# Altium schematic sheet 05 - USB.SchDoc
size 420 x 297 mm
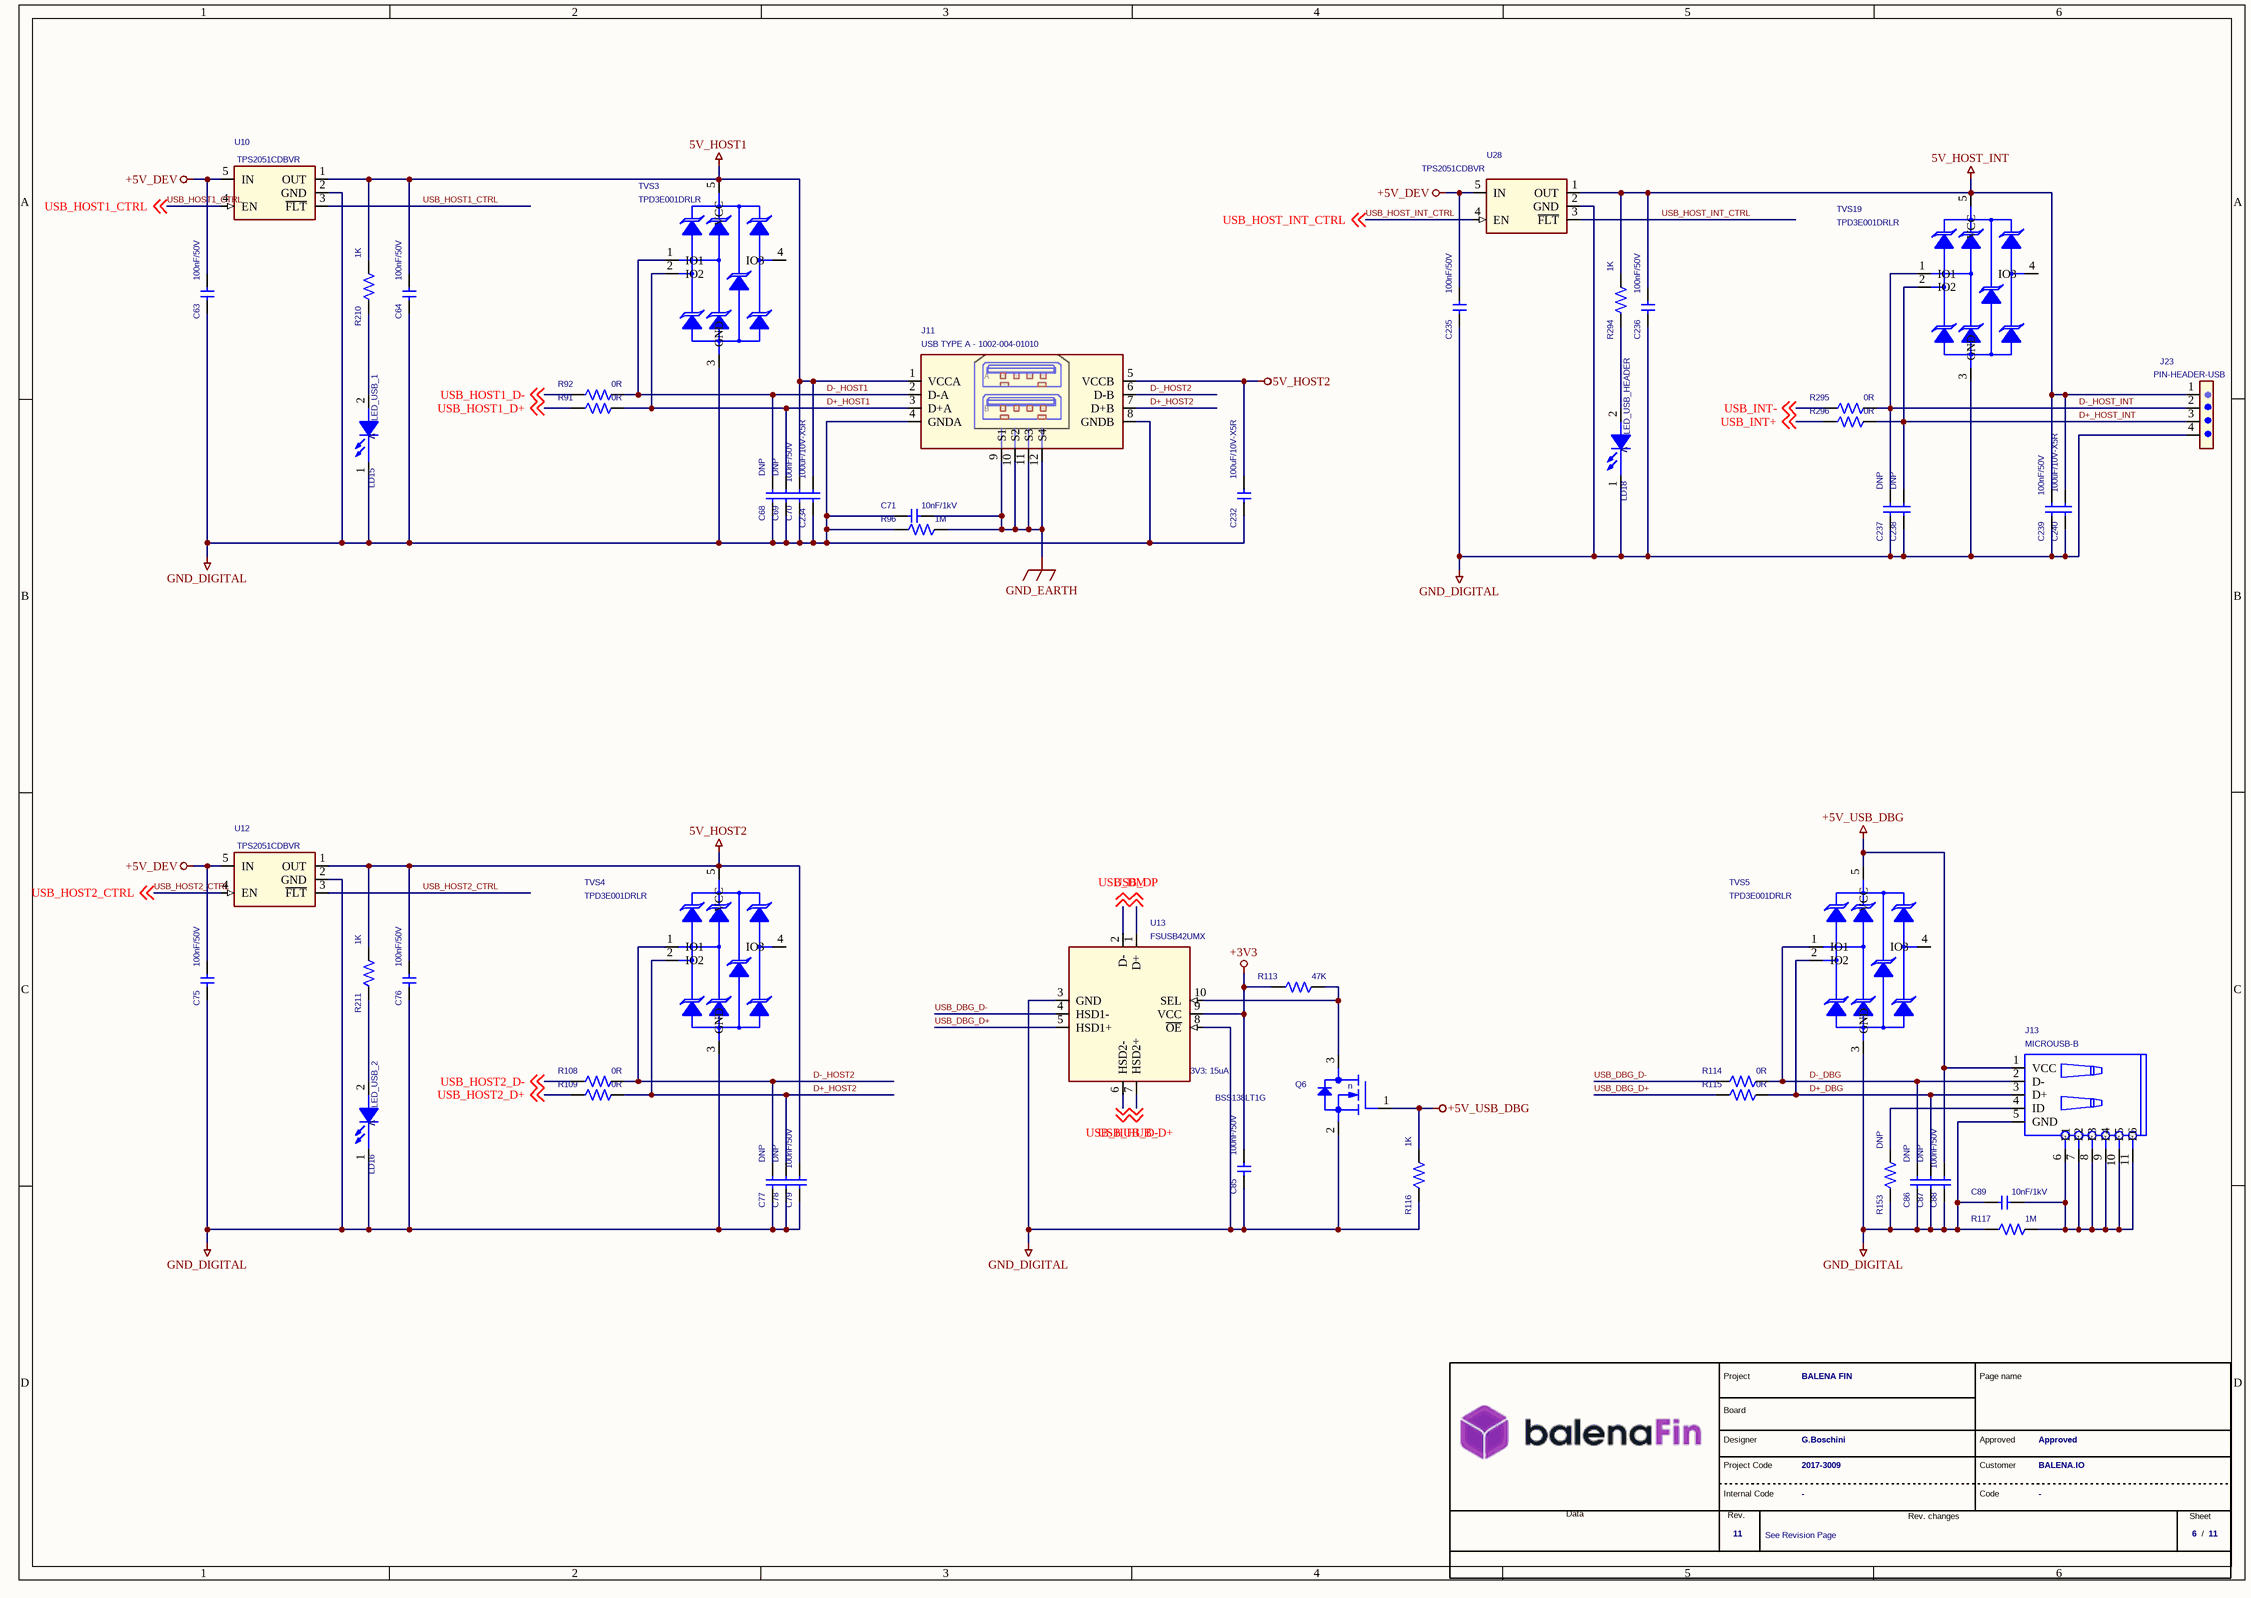
[diagram p0: 05 - USB.SchDoc]

## Parts
*  Revision: 11  FAE RD code: 2017-3009  DocumentoRev: See Revision Page  Page Number: 6  Nome Progetto: BALENA FIN  Customer name: BALENA.IO  Project manager: Approved  Project designer: G.Boschini  (hidden comment: MyFAEVuoto)  (graphical)
C63  100nF/50V  [CS-C-0402]
C64  100nF/50V  [CS-C-0402]
C68  DNP  [CS-C-0402]
C69  DNP  [CS-C-0402]
C70  100nF/50V  [CS-C-0402]
C71  10nF/1kV  [CS-C-1206]
C75  100nF/50V  [CS-C-0402]
C76  100nF/50V  [CS-C-0402]
C77  DNP  [CS-C-0402]
C78  DNP  [CS-C-0402]
C79  100nF/50V  [CS-C-0402]
C85  100nF/50V  [CS-C-0402]
C86  DNP  [CS-C-0402]
C87  DNP  [CS-C-0402]
C88  100nF/50V  [CS-C-0402]
C89  10nF/1kV  [CS-C-1206]
C232  100uF/10V-X5R  [CS-C-1210]
C234  100uF/10V-X5R  [CS-C-1210]
C235  100nF/50V  [CS-C-0402]
C236  100nF/50V  [CS-C-0402]
C237  DNP  [CS-C-0402]
C238  DNP  [CS-C-0402]
C239  100nF/50V  [CS-C-0402]
C240  100uF/10V-X5R  [CS-C-1210]
J11  USB TYPE A - 1002-004-01010  [J-8-0200-FOT-USB-A-2X]
J13  MICROUSB-B  [J-5-0065-FOS-MICROUSB10118192]
J23  PIN-HEADER-USB  [J-4-0254-MDT]
LD15  LED_USB_1  [LD-0603]
LD16  LED_USB_2  [LD-0603]
LD18  LED_USB_HEADER  [LD-0603]
Q6  BSS138LT1G  [SOT23]
R91  0R  [RS-0402]
R92  0R  [RS-0402]
R96  1M  [RS-1206]
R108  0R  [RS-0402]
R109  0R  [RS-0402]
R113  47K  [RS-0402]
R114  0R  [RS-0402]
R115  0R  [RS-0402]
R116  1K  [RS-0402]
R117  1M  [RS-1206]
R153  DNP  [RS-0402]
R210  1K  [RS-0402]
R211  1K  [RS-0402]
R294  1K  [RS-0402]
R295  0R  [RS-0402]
R296  0R  [RS-0402]
TVS3  TPD3E001DRLR  [SOP5_USON6]
TVS4  TPD3E001DRLR  [SOP5_USON6]
TVS5  TPD3E001DRLR  [SOP5_USON6]
TVS19  TPD3E001DRLR  [SOP5_USON6]
U10  TPS2051CDBVR  [SOT23-5]
U12  TPS2051CDBVR  [SOT23-5]
U13  FSUSB42UMX  Power requirements: 3V3: 15uA  [UMLP10]
U28  TPS2051CDBVR  [SOT23-5]

## Nets
5V_HOST1: C64.1 C70.1 C234.1 J11.1(VCCA) R210.2 TVS3.5(VCC) U10.1(OUT)
5V_HOST2: C76.1 C79.1 C232.1 J11.5(VCCB) R211.2 TVS4.5(VCC) U12.1(OUT)
5V_HOST_INT: C236.1 C239.1 C240.1 J23.1 R294.2 TVS19.5(VCC) U28.1(OUT)
+3V3: C85.1 R113.1 U13.9(VCC)
+5V_DEV: C63.1 C75.1 C235.1 U10.5(IN) U12.5(IN) U28.5(IN)
+5V_USB_DBG: C88.1 J13.1(VCC) Q6.1(G) R116.2 TVS5.5(VCC)
GND_DIGITAL: C63.2 C64.2 C68.2 C69.2 C70.2 C71.1 C75.2 C76.2 C77.2 C78.2 C79.2 C85.2 C86.2 C87.2 C88.2 C89.1 C232.2 C234.2 C235.2 C236.2 C237.2 C238.2 C239.2 C240.2 J11.4(GNDA) J11.8(GNDB) J13.5(GND) J23.4 LD15.1(C) LD16.1(C) LD18.1(C) Q6.2(S) R96.1 R116.1 R117.1 R153.1 TVS3.3(GND) TVS4.3(GND) TVS5.3(GND) TVS19.3(GND) U10.2(GND) U12.2(GND) U13.3(GND) U13.8(~{OE}) U28.2(GND)
GND_EARTH: C71.2 J11.9(S1) J11.10(S2) J11.11(S3) J11.12(S4) R96.2
D+_DBG: C87.1 J13.3(D+) R115.2 TVS5.2(IO2)
D+_HOST1: C69.1 J11.3(D+A) R91.2 TVS3.2(IO2)
D+_HOST2: C78.1 J11.7(D+B) R109.2 TVS4.2(IO2)
D+_HOST_INT: C238.1 J23.3 R296.2 TVS19.2(IO2)
D-_DBG: C86.1 J13.2(D-) R114.2 TVS5.1(IO1)
D-_HOST1: C68.1 J11.2(D-A) R92.2 TVS3.1(IO1)
D-_HOST2: C77.1 J11.6(D-B) R108.2 TVS4.1(IO1)
D-_HOST_INT: C237.1 J23.2 R295.2 TVS19.1(IO1)
USB_DBG_D+: R115.1 U13.5(HSD1+)
USB_DBG_D-: R114.1 U13.4(HSD1-)
USB_DM: U13.2(D-) ; off-sheet USB_DM
USB_DP: U13.1(D+) ; off-sheet USB_DP
USB_HOST1_CTRL: U10.3(~{FLT}) U10.4(EN) ; off-sheet USB_HOST1_CTRL
USB_HOST1_D+: R91.1 ; off-sheet USB_HOST1_D+
USB_HOST1_D-: R92.1 ; off-sheet USB_HOST1_D-
USB_HOST2_CTRL: U12.3(~{FLT}) U12.4(EN) ; off-sheet USB_HOST2_CTRL
USB_HOST2_D+: R109.1 ; off-sheet USB_HOST2_D+
USB_HOST2_D-: R108.1 ; off-sheet USB_HOST2_D-
USB_HOST_INT_CTRL: U28.3(~{FLT}) U28.4(EN) ; off-sheet USB_HOST_INT_CTRL
USB_HUB_D+: U13.7(HSD2+) ; off-sheet USB_HUB_D+
USB_HUB_D-: U13.6(HSD2-) ; off-sheet USB_HUB_D-
USB_INT+: R296.1 ; off-sheet USB_INT+
USB_INT-: R295.1 ; off-sheet USB_INT-
NetC89_2: C89.2 J13.6(E1) J13.7(E2) J13.8(E3) J13.9(E4) J13.10(E5) J13.11(E6) R117.2
NetJ13_4: J13.4(ID) R153.2
NetLD15_2: LD15.2(A) R210.1
NetLD16_2: LD16.2(A) R211.1
NetLD18_2: LD18.2(A) R294.1
NetQ6_3: Q6.3(D) R113.2 U13.10(SEL)

Not connected (* = marked no-connect by the designer): TVS3 4(IO3); TVS4 4(IO3); TVS5 4(IO3); TVS19 4(IO3)

## Notes on the sheet
- (in symbol LED V - GENERICO - 0603) V
- (in symbol MyFAEVuoto) Project; Page name; Board; Designer; Project Code; Customer; Internal Code; Code; Data; Rev.; Rev. changes; Sheet; /
- (in symbol NMOS - BSS138 - 0.2A/50V) n
- (in symbol USB - J-8-0200-FOT-USB-A-2X) A; B

## Library data of the parts
C63 C64 C70 C235 C236 C239 = CS-C-0402-100n/16V: CHIP CAP.CER. 100nF 16V 10% X7R 0402; MPN: Generic; Alternative MPN: C0402C104K4RACTU; Room: USB HOST 1; Pkg Type: SMD; Mount: Yes
C68 C69 C237 C238 = CS-C-0402: CHIP CAP.CER. 0402; MPN: Generic; Room: USB HOST 1; Pkg Type: SMD; Mount: No
C71 = CS-C-1206-10n/1kV: CHIP CAP.CER. 10nF 1000V 10% X7R 1206; MPN: Generic; Alternative MPN: GRM31CR73A103KW03L; Room: USB HOST 1; Pkg Type: SMD; Mount: Yes
C75 C76 C79 = CS-C-0402-100n/16V: CHIP CAP.CER. 100nF 16V 10% X7R 0402; MPN: Generic; Alternative MPN: C0402C104K4RACTU; Room: USB HOST 2; Pkg Type: SMD; Mount: Yes
C77 C78 = CS-C-0402: CHIP CAP.CER. 0402; MPN: Generic; Room: USB HOST 2; Pkg Type: SMD; Mount: No
C85 = CS-C-0402-100n/16V: CHIP CAP.CER. 100nF 16V 10% X7R 0402; MPN: Generic; Alternative MPN: C0402C104K4RACTU; Room: SWITCH USB; Pkg Type: SMD; Mount: Yes
C86 C87 = CS-C-0402: CHIP CAP.CER. 0402; MPN: Generic; Room: USB BOOT; Pkg Type: SMD; Mount: No
C88 = CS-C-0402-100n/16V: CHIP CAP.CER. 100nF 16V 10% X7R 0402; MPN: Generic; Alternative MPN: C0402C104K4RACTU; Room: USB BOOT; Pkg Type: SMD; Mount: Yes
C89 = CS-C-1206-10n/1kV: CHIP CAP.CER. 10nF 1000V 10% X7R 1206; MPN: Generic; Alternative MPN: GRM31CR73A103KW03L; Room: USB BOOT; Pkg Type: SMD; Mount: Yes
C232 = CS-C-1210-100u/10V-X5R: CHIP CAP.CER. 100UF 10V 20% X5R 1210; MPN: Generic; Pkg Type: SMD; Room: USB HOST 2; Mount: Yes
C234 C240 = CS-C-1210-100u/10V-X5R: CHIP CAP.CER. 100UF 10V 20% X5R 1210; MPN: Generic; Pkg Type: SMD; Room: USB HOST 1; Mount: Yes
J11 = USB - J-8-0200-FOT-USB-A-2X: USB-A (USB TYPE-A), Stacked USB 2.0 Receptacle Connector 8 Position Through Hole, Right Angle; Alternative MPN: 672983091; Pkg Type: THT; Room: USB HOST 1; Temperature range: -55°..+85°; MPN: 1002-004-01010; Mount: Yes
J13 = USB - MICROUSB-B-FCI10118192: USB - micro B USB 2.0 Receptacle Connector 5 Position Surface Mount, Right Angle; MPN: 10118192-0001LF; Pkg Type: SMD; Note: Full SMD; Room: USB BOOT; Temperature range: -30°..+85°; Mount: Yes
J23 = STRIP-J-4-0254-MDT: CONN HEADER THT 4POS 2.54MM SINGLE ROW; MPN: Generic; Alternative MPN: SL11/112/4/G; Pkg Type: THT; Mount: Yes
LD15 LD18 = LED V - GENERICO - 0603: LED Green 0603 SMT; Alternative MPN: KP-1608SGC; Pkg Type: SMD; Note: V=2.2V/20mA; Room: USB HOST 1; MPN: Generic; Mount: Yes
LD16 = LED V - GENERICO - 0603: LED Green 0603 SMT; Alternative MPN: KP-1608SGC; Pkg Type: SMD; Note: V=2.2V/20mA; Room: USB HOST 2; MPN: Generic; Mount: Yes
Q6 = NMOS - BSS138 - 0.2A/50V: MOSFET N-CH 50V 220MA SOT23-3; Room: SWITCH USB; Pkg Type: SMD; MPN: BSS138LT1G; Mount: Yes
R91 R92 R295 R296 = RS-0402-0r: CHIP RES. 0R 0402 1/16W 1%; MPN: Generic; Room: USB HOST 1; Pkg Type: SMD; Mount: Yes
R96 = RS-1206-1M: CHIP RES. 1M 1206 1/4W 1%; MPN: Generic; Pkg Type: SMD; Room: USB HOST 1; Mount: Yes
R108 R109 = RS-0402-0r: CHIP RES. 0R 0402 1/16W 1%; MPN: Generic; Room: USB HOST 2; Pkg Type: SMD; Mount: Yes
R113 = RS-0402-47k: CHIP RES. 47K 0402 1/16W 1% 100PPM/°C; MPN: Generic; Pkg Type: SMD; Note: 100ppm; Room: SWITCH USB; Mount: Yes
R114 R115 = RS-0402-0r: CHIP RES. 0R 0402 1/16W 1%; MPN: Generic; Room: USB BOOT; Pkg Type: SMD; Mount: Yes
R116 = RS-0402-1k: CHIP RES. 1K 0402 1/16W 1%; MPN: Generic; Pkg Type: SMD; Room: POWER LED; Mount: Yes
R117 = RS-1206-1M: CHIP RES. 1M 1206 1/4W 1%; MPN: Generic; Pkg Type: SMD; Room: USB BOOT; Mount: Yes
R153 = RS-0402: CHIP RES. 0402; MPN: Generic; Pkg Type: SMD; Room: USB BOOT; Mount: No
R210 R294 = RS-0402-1k: CHIP RES. 1K 0402 1/16W 1%; MPN: Generic; Pkg Type: SMD; Room: USB HOST 1; Mount: Yes
R211 = RS-0402-1k: CHIP RES. 1K 0402 1/16W 1%; MPN: Generic; Pkg Type: SMD; Room: USB HOST 2; Mount: Yes
TVS3 = TVS-UNI3x - TPD3E001DRLR - USB: TVS DIODE 5.5VWM; Alternative MPN: TPD3E001DRYR; Note: Unidirectional - High-Speed Data Interface - USB; Pkg Type: SMD; Room: USB HOST 1; Temperature range: -40°..+85°; MPN: TPD3E001DRLR; Mount: Yes
TVS4 = TVS-UNI3x - TPD3E001DRLR - USB: TVS DIODE 5.5VWM; Note: Unidirectional - High-Speed Data Interface - USB; Pkg Type: SMD; Room: USB HOST 2; Temperature range: -40°..+85°; MPN: TPD3E001DRLR; Mount: Yes
TVS5 = TVS-UNI3x - TPD3E001DRLR - USB: TVS DIODE 5.5VWM; Note: Unidirectional - High-Speed Data Interface - USB; Pkg Type: SMD; Room: USB BOOT; Temperature range: -40°..+85°; MPN: TPD3E001DRLR; Mount: Yes
TVS19 = TVS-UNI3x - TPD3E001DRLR - USB: TVS DIODE 5.5VWM; Note: Unidirectional - High-Speed Data Interface - USB; Pkg Type: SMD; Room: USB HOST 1; Temperature range: -40°..+85°; MPN: TPD3E001DRLR; Mount: Yes
U10 U28 = USB-PSW - TPS2051CDBVR: Power Switch/Driver 1:1 N-Channel 500mA SOT-23-5; Room: USB HOST 1; Pkg Type: SMD; Note: Active High EN; Temperature range: -40°..+125°; MPN: TPS2051CDBVR; Mount: Yes
U12 = USB-PSW - TPS2051CDBVR: Power Switch/Driver 1:1 N-Channel 500mA SOT-23-5; Room: USB HOST 2; Pkg Type: SMD; Note: Active High EN; Temperature range: -40°..+125°; MPN: TPS2051CDBVR; Mount: Yes
U13 = SWITCH-USB - FSUSB42UMX: USB Switch IC 1 Channel 10-UMLP (1.8x1.4); Room: SWITCH USB; Pkg Type: SMD; Temperature range: -40°..+85°; MPN: FSUSB42UMX; Mount: Yes
* = MyFAEVuoto: Page Count: 11; Customer Code: -; Database: -